# Altium schematic sheet ALCT2017_Logic.SchDoc: Overview
size B; Organization: UCLA High Energy Physics; DocumentNumber: 1; Revision: 2.0; SheetNumber: 1; SheetTotal: 23; CurrentDate: 9/6/2018; DocumentName: Overview; ModifiedDate: 9/6/2018
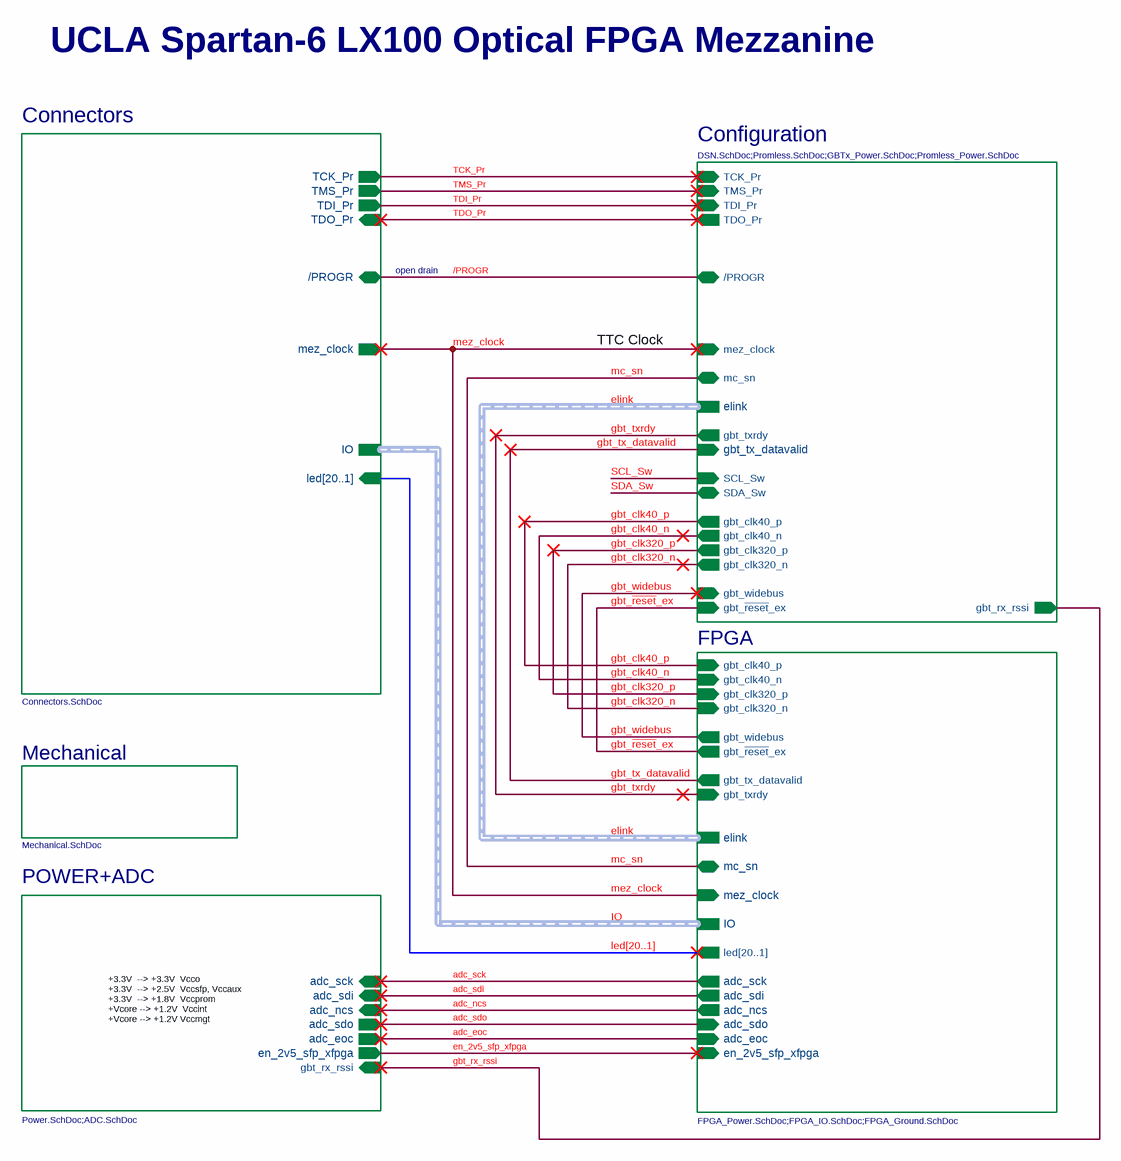
[diagram p0: ALCT2017_Logic.SchDoc]

## Sub-sheets
Configuration = DSN.SchDoc;Promless.SchDoc;GBTx_Power.SchDoc;Promless_Power.SchDoc: TDO_Pr (out), TDI_Pr (in), TCK_Pr (in), TMS_Pr (in), /PROGR (bidir), elink (harness E-Link), SDA_Sw (bidir), SCL_Sw (in), gbt_rx_rssi (out), mez_clock (in), mc_sn (bidir), gbt_txrdy (out), gbt_tx_datavalid (in), gbt_clk40_p (out), gbt_clk40_n (out), gbt_clk320_p (out), gbt_clk320_n (out), gbt_widebus (in), gbt_~{reset}_ex (in)
Connectors = Connectors.SchDoc: TCK_Pr (out), TMS_Pr (out), TDI_Pr (out), TDO_Pr (in), /PROGR (bidir), IO (harness Samtec IO), led[20..1] (in), mez_clock (out)
FPGA = FPGA_Power.SchDoc;FPGA_IO.SchDoc;FPGA_Ground.SchDoc: adc_sck (out), adc_sdi (out), adc_ncs (out), adc_sdo (in), adc_eoc (in), led[20..1] (out), gbt_clk40_p (in), gbt_clk40_n (in), gbt_clk320_p (in), gbt_clk320_n (in), IO (harness Samtec IO), mez_clock (in), mc_sn (bidir), elink (harness E-Link), gbt_tx_datavalid (out), gbt_txrdy (in), gbt_widebus (out), en_2v5_sfp_xfpga (in), gbt_~{reset}_ex (out)
Mechanical = Mechanical.SchDoc: no entries
POWER+ADC = Power.SchDoc;ADC.SchDoc: adc_sdo (out), adc_eoc (out), adc_sck (in), adc_sdi (in), adc_ncs (in), gbt_rx_rssi (in), en_2v5_sfp_xfpga (out)

## Nets
/PROGR: sheet Connectors//PROGR, sheet Configuration//PROGR
adc_eoc: sheet FPGA/adc_eoc, sheet POWER+ADC/adc_eoc
adc_ncs: sheet FPGA/adc_ncs, sheet POWER+ADC/adc_ncs
adc_sck: sheet FPGA/adc_sck, sheet POWER+ADC/adc_sck
adc_sdi: sheet FPGA/adc_sdi, sheet POWER+ADC/adc_sdi
adc_sdo: sheet FPGA/adc_sdo, sheet POWER+ADC/adc_sdo
en_2v5_sfp_xfpga: sheet FPGA/en_2v5_sfp_xfpga, sheet POWER+ADC/en_2v5_sfp_xfpga
gbt_clk40_n: sheet FPGA/gbt_clk40_n, sheet Configuration/gbt_clk40_n
gbt_clk40_p: sheet FPGA/gbt_clk40_p, sheet Configuration/gbt_clk40_p
gbt_clk320_n: sheet FPGA/gbt_clk320_n, sheet Configuration/gbt_clk320_n
gbt_clk320_p: sheet FPGA/gbt_clk320_p, sheet Configuration/gbt_clk320_p
gbt_~{reset}_ex: sheet FPGA/gbt_~{reset}_ex, sheet Configuration/gbt_~{reset}_ex
gbt_rx_rssi: sheet POWER+ADC/gbt_rx_rssi, sheet Configuration/gbt_rx_rssi
gbt_tx_datavalid: sheet FPGA/gbt_tx_datavalid, sheet Configuration/gbt_tx_datavalid
gbt_txrdy: sheet FPGA/gbt_txrdy, sheet Configuration/gbt_txrdy
gbt_widebus: sheet FPGA/gbt_widebus, sheet Configuration/gbt_widebus
mc_sn: sheet FPGA/mc_sn, sheet Configuration/mc_sn
mez_clock: sheet Connectors/mez_clock, sheet FPGA/mez_clock, sheet Configuration/mez_clock
SCL_Sw: sheet Configuration/SCL_Sw
SDA_Sw: sheet Configuration/SDA_Sw
TCK_Pr: sheet Connectors/TCK_Pr, sheet Configuration/TCK_Pr
TDI_Pr: sheet Connectors/TDI_Pr, sheet Configuration/TDI_Pr
TDO_Pr: sheet Connectors/TDO_Pr, sheet Configuration/TDO_Pr
TMS_Pr: sheet Connectors/TMS_Pr, sheet Configuration/TMS_Pr

## Buses and harness runs
bus led[20..1] = sheet Connectors/led[20..1] = sheet FPGA/led[20..1]
harness elink = sheet Configuration/elink = sheet FPGA/elink
harness IO = sheet Connectors/IO = sheet FPGA/IO

## Notes on the sheet
- UCLA Spartan-6 LX100 Optical FPGA Mezzanine
- open drain
- TTC Clock
- +3.3V  --> +3.3V  Vcco
  +3.3V  --> +2.5V  Vccsfp, Vccaux
  +3.3V  --> +1.8V  Vccprom
  +Vcore --> +1.2V  Vccint
  +Vcore --> +1.2V Vccmgt
- Date:
- Rev:
- of
- Sheet